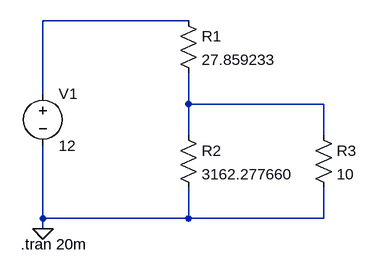
[diagram p0: schematic divider.asc]
divider.asc, the LTspice schematic file:
Version 4
SHEET 1 880 680
WIRE 192 80 -32 80
WIRE -32 192 -32 80
WIRE 192 208 192 160
WIRE 400 208 192 208
WIRE 192 256 192 208
WIRE 400 256 400 208
WIRE -32 384 -32 272
WIRE 192 384 192 336
WIRE 192 384 -32 384
WIRE 400 384 400 336
WIRE 400 384 192 384
WIRE -32 400 -32 384
FLAG -32 400 0
SYMBOL res 176 64 R0
SYMATTR InstName R1
SYMATTR Value 27.859233
SYMBOL res 176 240 R0
SYMATTR InstName R2
SYMATTR Value 3162.277660
SYMBOL voltage -32 176 R0
WINDOW 123 0 0 Left 0
WINDOW 39 0 0 Left 0
SYMATTR InstName V1
SYMATTR Value 12
SYMBOL res 384 240 R0
SYMATTR InstName R3
SYMATTR Value 10
TEXT -66 424 Left 2 !.tran 20m

The netlist it stands for:
* divider.asc
R1 N001 N002 27.859233
R2 N002 0 3162.277660
V1 N001 0 12
R3 N002 0 10
.tran 20m
.backanno
.end